# EAGLE design breakoutboard (EAGLE 9.6.2)
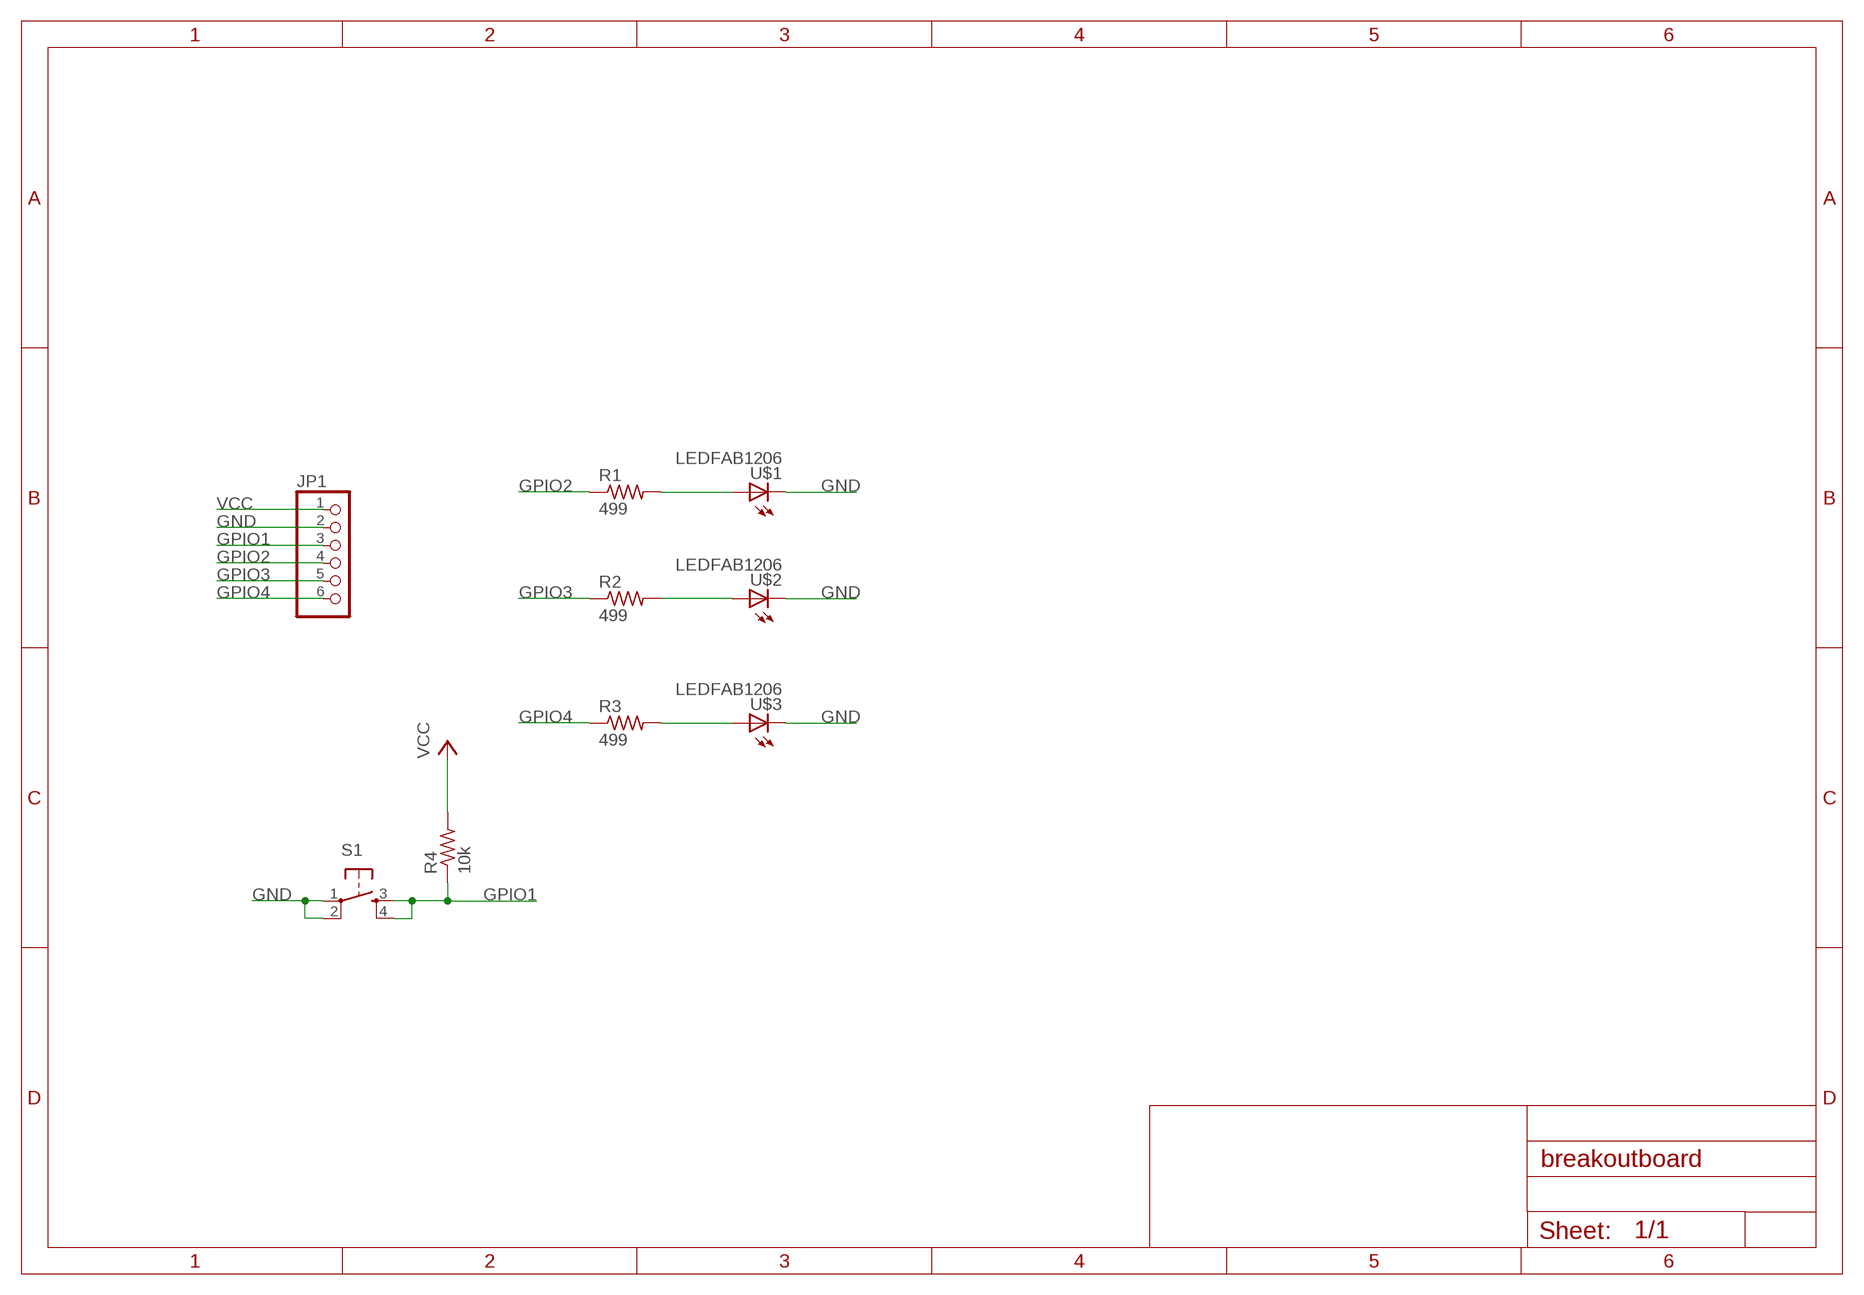
[diagram p0: schematic, sheet 1]

## Parts
JP1  PINHD-1X6  [1X06]
R1  499  R1206FAB  [R1206FAB]
R2  499  R1206FAB  [R1206FAB]
R3  499  R1206FAB  [R1206FAB]
R4  10k  R1206FAB  [R1206FAB]
S1  SW_SWITCH_TACTILE_6MM6MM_SWITCH  [6MM_SWITCH]
U$1  LEDFAB1206  [LED1206FAB]
U$2  LEDFAB1206  [LED1206FAB]
U$3  LEDFAB1206  [LED1206FAB]

## Nets
GND: JP1.2 S1.1(P) S1.2(P1) U$1.2(C) U$2.2(C) U$3.2(C)
GPIO1: JP1.3 R4.1 S1.3(S) S1.4(S1)
GPIO2: JP1.4 R1.1
GPIO3: JP1.5 R2.1
GPIO4: JP1.6 R3.1
N$2: R1.2 U$1.1(A)
N$4: R2.2 U$2.1(A)
N$6: R3.2 U$3.1(A)
VCC: JP1.1 R4.2

## Library data of the parts
JP1 = pinhead:PINHD-1X6: PIN HEADER
R1-R4 = eagle_fab:R: Resistor (US Symbol) Variants with postfix FAB are widened to allow the routing of internal traces
S1 = eagle_fab:SW_SWITCH_TACTILE_6MM: OMRON SWITCH
U$1-U$3 = eagle_fab:LED: LED

## Board
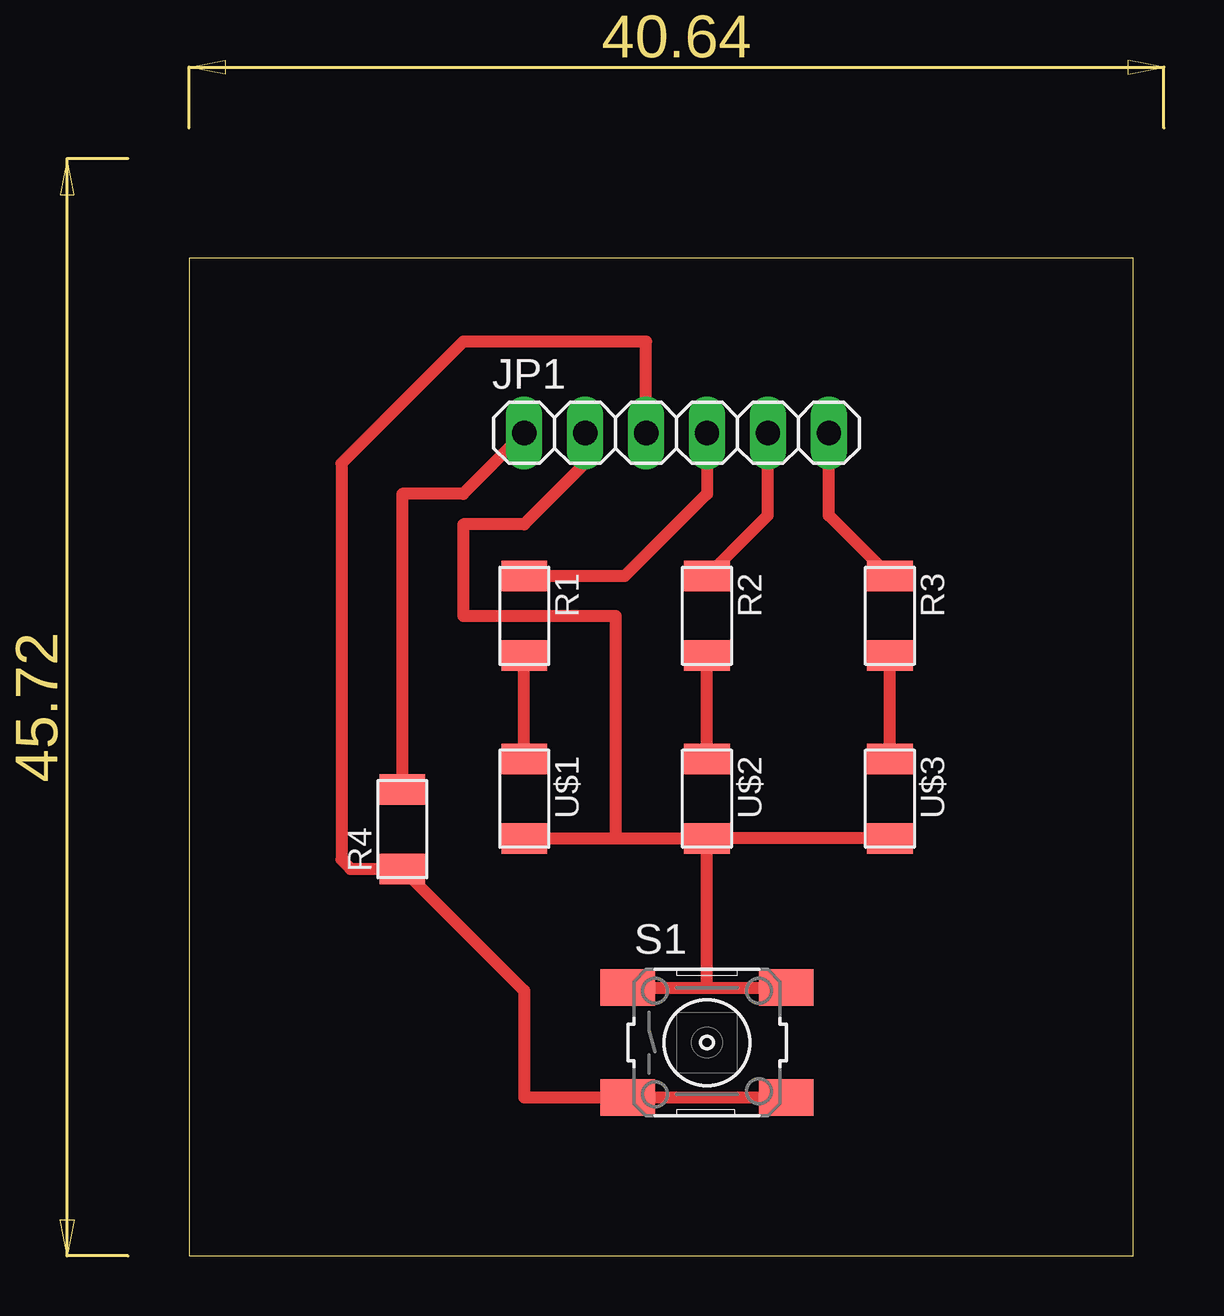
[diagram p1: board, top side]

Size 39.35 x 41.58 mm. Coordinates in mm from the lower left corner, seen from the top.
Outline: 0,0 39.35,0 39.35,41.58 0,41.58 0,0
Copper layers (1*16): Top 0.035mm / dielectric 1.5mm / Bottom 0.035mm
Design rules "default *": minimum track width 16mil, minimum drill 0.35mm, track to track 16mil, track to pad 16mil, pad to pad 16mil, via to via 6mil, smd to smd 6mil, copper to edge 40mil, drill to drill 6mil, minimum pad ring 10mil, minimum via ring 8mil, stop-mask expansion 4mil, vias tented up to drill 0mil, thermal gap 10mil

### Footprints (pad centres in the part's own frame; a part is rotated, then mirrored left to right if it is on the bottom)
1X06 = drill 1.016 long: 1 -6.35,0; 2 -3.81,0; 3 -1.27,0; 4 1.27,0; 5 3.81,0; 6 6.35,0
R1206FAB = smd 1.27 x 1.905: 1 -1.651,0; 2 1.651,0
6MM_SWITCH = smd 2.286 x 1.524: 1 -3.302,2.286; 2 3.302,2.286; 3 -3.302,-2.286; 4 3.302,-2.286
LED1206FAB = smd 1.27 x 1.905: 1 -1.651,0; 2 1.651,0

### Placement (x,y rotation side)
JP1  20.32,34.29 0 top
R1  13.97,26.67 270 top
R2  21.59,26.67 270 top
R3  29.21,26.67 270 top
R4  8.89,17.78 90 top
S1  21.59,8.89 0 top
U$1  13.97,19.05 270 top
U$2  21.59,19.05 270 top
U$3  29.21,19.05 270 top

### Tracks (layer width: path | path; a pad name or v marks a point on that pad's centre or on a via)
GND
  Top 0.508: S1.1 21.59,11.18 | 21.59,11.18 S1.2 | U$1.2 17.78,17.4 | 17.78,17.4 U$2.2 | U$3.2 U$2.2 | 21.59,11.18 U$2.2 | 17.78,17.4 17.78,26.67 11.43,26.67 11.43,30.48 13.97,30.48 16.51,33.02 JP1.2
GPIO1
  Top 0.508: S1.4 S1.3 13.97,6.6 13.97,11.05 R4.1 6.73,16.13 6.35,16.51 6.35,33.02 11.43,38.1 19.05,38.1 JP1.3
GPIO2
  Top 0.508: R1.1 18.16,28.32 21.59,31.75 JP1.4
GPIO3
  Top 0.508: R2.1 24.13,30.86 JP1.5
GPIO4
  Top 0.508: R3.1 26.67,30.86 JP1.6
N$2
  Top 0.508: U$1.1 R1.2
N$4
  Top 0.508: U$2.1 R2.2
N$6
  Top 0.508: U$3.1 R3.2
VCC
  Top 0.508: JP1.1 11.43,31.75 8.89,31.75 R4.2